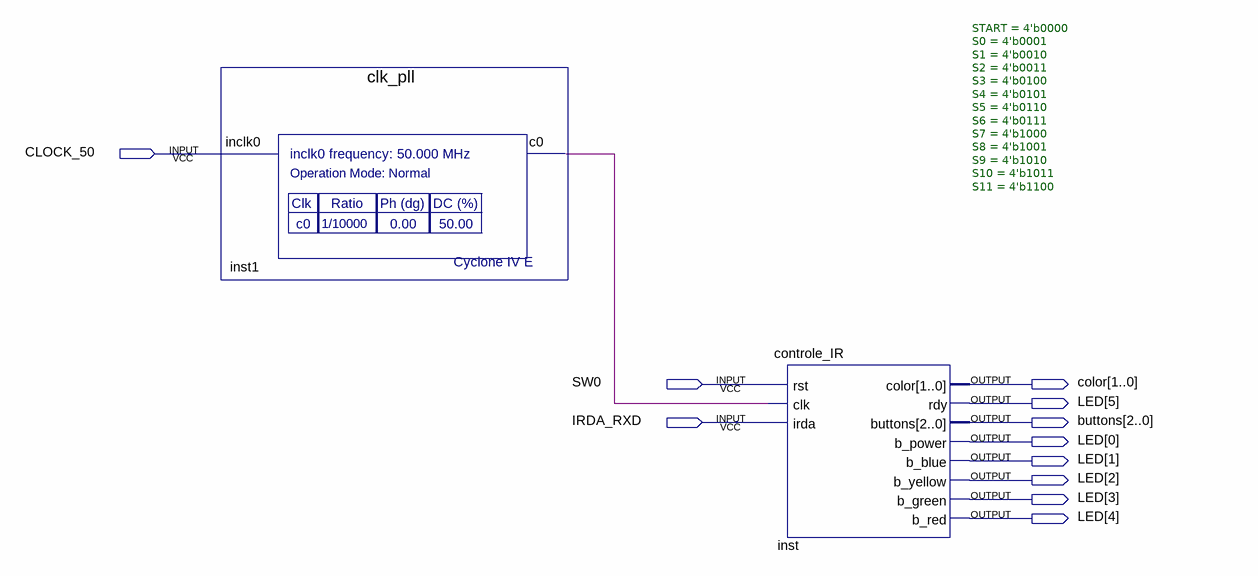
[diagram p0: schematic sheet]
// Quartus schematic controle.bdf as structural Verilog: 2 symbols, 11 pins
module controle (
  input  CLOCK_50,
  input  SW0,
  input  IRDA_RXD,
  output [1:0] color,
  output [5:0] LED,
  output [2:0] buttons
);

  wire inst1_c0;

  clk_pll inst1 (.inclk0(CLOCK_50), .c0(inst1_c0));
  controle_IR #(.START(4'b0000), .S0(4'b0001), .S1(4'b0010), .S2(4'b0011), .S3(4'b0100), .S4(4'b0101), .S5(4'b0110), .S6(4'b0111), .S7(4'b1000), .S8(4'b1001), .S9(4'b1010), .S10(4'b1011), .S11(4'b1100)) inst (
    .rst(SW0), .clk(inst1_c0), .irda(IRDA_RXD), .color(color), .rdy(LED[5]), .buttons(buttons),
    .b_power(LED[0]), .b_blue(LED[1]), .b_yellow(LED[2]), .b_green(LED[3]), .b_red(LED[4]));
endmodule
